# EAGLE design Board_v01 (EAGLE 8.1.0)
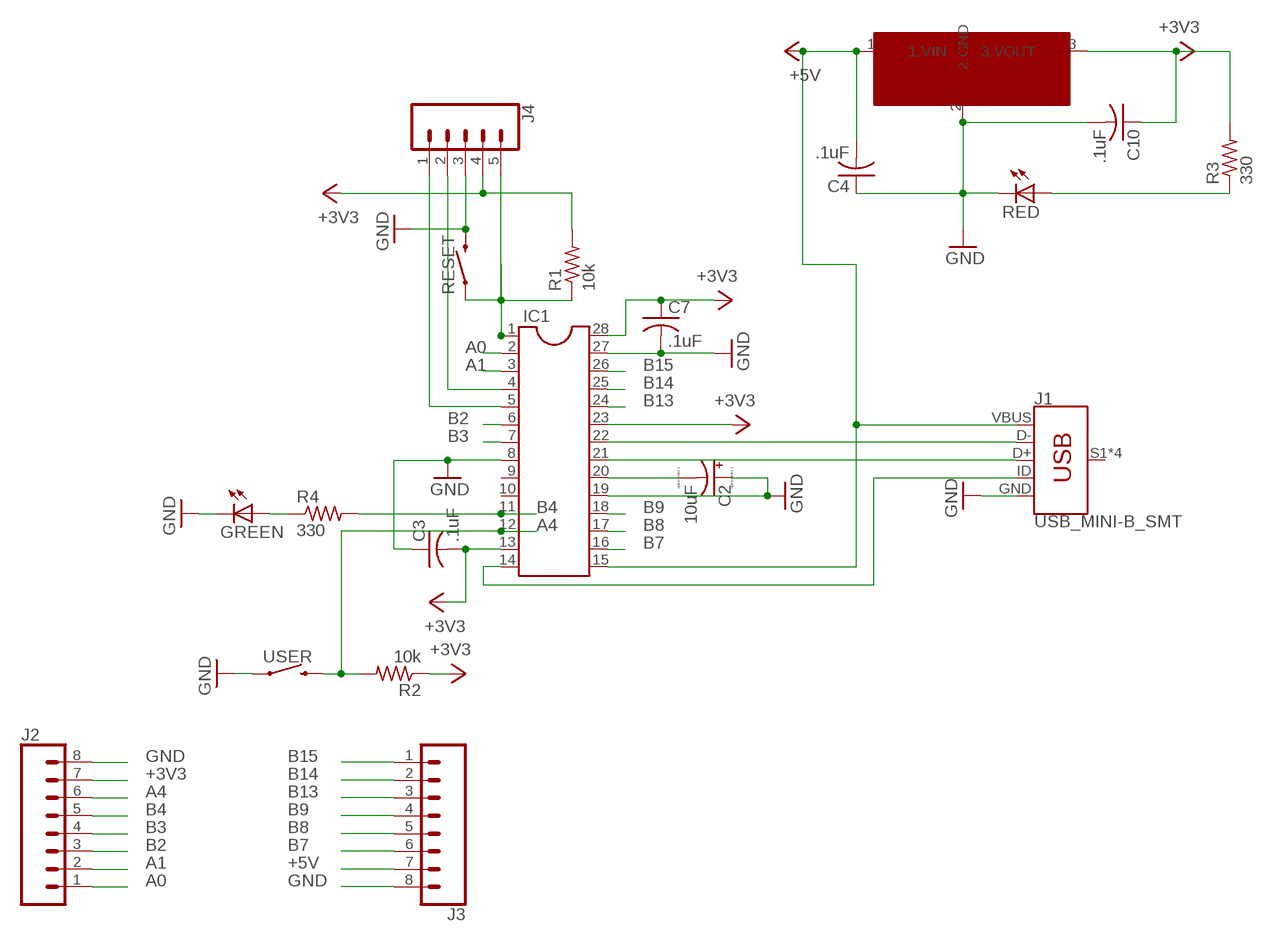
[diagram p0: schematic, sheet 1]

## Parts
C2  10uF  CPOL-USCT7343  [CT7343]
C3  .1uF  C-US025-025X050  [C025-025X050]
C4  .1uF  C-US025-025X050  [C025-025X050]
C7  .1uF  C-US025-025X050  [C025-025X050]
C10  .1uF  C-US025-025X050  [C025-025X050]
GREEN  LED3MM  [LED3MM]
IC1  DIL28-3  [DIL28-3]
J1  USB_MINI-B_SMT  [USB-MINIB]
J2  CONN_08"  [1X08]
J3  CONN_08"  [1X08]
J4  CONN_05  [1X05]
R1  10k  R-US_0204/5  [0204/5]
R2  10k  R-US_0204/5  [0204/5]
R3  330  R-US_0204/5  [0204/5]
R4  330  R-US_0204/5  [0204/5]
RED  LED3MM  [LED3MM]
RESET  MOMENTARY-SWITCH-SPST-PTH-6.0MM  [TACTILE_SWITCH_PTH_6.0MM]
U$1  MCP1702  [TO92]
USER  MOMENTARY-SWITCH-SPST-PTH-6.0MM  [TACTILE_SWITCH_PTH_6.0MM]

## Nets
+3V3: C3.2 C7.1 C10.1 IC1.13 IC1.23 IC1.28 J2.7 J4.4 R1.2 R2.1 R3.2 U$1.3(3.VOUT)
+5V: C4.2 IC1.15 J1.VBUS J3.7 U$1.1(1.VIN)
A0: IC1.2 J2.1
A1: IC1.3 J2.2
A4: IC1.12 J2.6 R2.2 USER.3
B2: IC1.6 J2.3
B3: IC1.7 J2.4
B4: IC1.11 J2.5 R4.2
B7: IC1.16 J3.6
B8: IC1.17 J3.5
B9: IC1.18 J3.4
B13: IC1.24 J3.3
B14: IC1.25 J3.2
B15: IC1.26 J3.1
GND: C2.+ C3.1 C4.1 C7.2 C10.2 GREEN.K(C) IC1.8 IC1.19 IC1.27 J1.GND J2.8 J3.8 J4.3 RED.K(C) RESET.3 U$1.2(2.GND) USER.1
N$1: IC1.1 J4.5 R1.1 RESET.1
N$2: IC1.4 J4.2
N$3: IC1.5 J4.1
N$4: IC1.22 J1.D-
N$5: IC1.21 J1.D+
N$7: IC1.14 J1.ID
N$8: C2.- IC1.20
N$9: GREEN.A R4.1
N$12: R3.1 RED.A
Unconnected: IC1.9 IC1.10 J1.S1(SHIELD) J1.S2(SHIELD) J1.S3(SHIELD) J1.S4(SHIELD)

## Library data of the parts
C2 = boardboardboard:CPOL-US: POLARIZED CAPACITOR, American symbol
C3 C4 C7 C10 = boardboardboard:C-US: CAPACITOR, American symbol
GREEN RED = boardboardboard:LED: LED OSRAM: - CHIPLED LG R971, LG N971, LY N971, LG Q971, LY Q971, LO R971, LY R971 LH N974, LH R974 LS Q976, LO Q976, LY Q976 LO Q996 - Hyper CHIPLED LW Q18S LB Q993, LB Q99A, LB R99A - SideLED LS A670, LO A670, LY A670, LG A670, LP A670 LB A673, LV A673, LT A673, LW A673 LH A674 LY A675 LS A676, LA A676, LO A676, LY A676, LW A676 LS A679, LY A679, LG A679 - Hyper Micro SIDELED® LS Y876, LA Y876, LO Y876, LY Y876 LT Y87S - SmartLED LW L88C, LW L88S LB L89C, LB L89S, LG L890 LS L89K, LO L89K, LY L89K LS L896, LA L896, LO L896, LY L896 - TOPLED LS T670, LO T670, LY T670, LG T670, LP T670 LSG T670, LSP T670, LSY T670, LOP T670, LYG T670 LG T671, LOG T671, LSG T671 LB T673, LV T673, LT T673, LW T673 LH T674 LS T676, LA T676, LO T676, LY T676, LB T676, LH T676, LSB T676, LW T676 LB T67C, LV T67C, LT T67C, LS T67K, LO T67K, LY T67K, LW E67C LS E67B, LA E67B, LO E67B, LY E67B, LB E67C, LV E67C, LT E67C LW T67C LS T679, LY T679, LG T679 LS T770, LO T770, LY T770, LG T770, LP T770 LB T773, LV T773, LT T773, LW T773 LH T774 LS E675, LA E675, LY E675, LS T675 LS T776, LA T776, LO T776, LY T776, LB T776 LHGB T686 LT T68C, LB T68C - Hyper Mini TOPLED® LB M676 - Mini TOPLED Santana® LG M470 LS M47K, LO M47K, LY M47K Source: http://www.osram.convergy.de LUXEON: - LUMILED® LXK2-PW12-R00, LXK2-PW12-S00, LXK2-PW14-U00, LXK2-PW14-V00 LXK2-PM12-R00, LXK2-PM12-S00, LXK2-PM14-U00 LXK2-PE12-Q00, LXK2-PE12-R00, LXK2-PE12-S00, LXK2-PE14-T00, LXK2-PE14-U00 LXK2-PB12-K00, LXK2-PB12-L00, LXK2-PB12-M00, LXK2-PB14-N00, LXK2-PB14-P00, LXK2-PB14-Q00 LXK2-PR12-L00, LXK2-PR12-M00, LXK2-PR14-Q00, LXK2-PR14-R00 LXK2-PD12-Q00, LXK2-PD12-R00, LXK2-PD12-S00 LXK2-PH12-R00, LXK2-PH12-S00 LXK2-PL12-P00, LXK2-PL12-Q00, LXK2-PL12-R00 Source: www.luxeon.com KINGBRIGHT: KA-3528ASYC Source: www.kingbright.com
IC1 = boardboardboard:DIL28: Dual In Line
J1 = boardboardboard:USB_MINI-B: USB type Mini-B Connector Breaks out 5th pin, and includes shield pins if needed. SparkFun Products: SparkFun FTDI Basic Breakout <https://www.sparkfun.com/products/9716> SparkFun XBee Explorer USB <https://www.sparkfun.com/products/11812> SparkFun Redboard <https://www.sparkfun.com/products/12757>; PROD_ID: CONN-08193; SF_ID: PRT-00587
J2 J3 = boardboardboard:CONN_08: Multi connection point. Often used as Generic Header-pin footprint for 0.1 inch spaced/style header connections On any of the 0.1 inch spaced packages, you can populate with these: Break Away Headers - Straight <https://www.sparkfun.com/products/116> (PRT-00116) Break Away Male Headers - Right Angle <https://www.sparkfun.com/products/553> (PRT-00553) Female Headers <https://www.sparkfun.com/products/115> (PRT-00115) Break Away Headers - Machine Pin <https://www.sparkfun.com/products/117> (PRT-00117) Break Away Female Headers - Swiss Machine Pin <https://www.sparkfun.com/products/743> (PRT-00743) Arduino Stackable Header - 8 Pin <https://www.sparkfun.com/products/9279> (PRT-09279) For SCREWTERMINALS and SPRING TERMINALS visit here: Screw Terimnals on SparkFun.com <https://www.sparkfun.com/search/results?term=Screw+Terminals> (5mm/3.5mm/2.54mm spacing) This device is also useful as a general connection point to wire up your design to another part of your project. Our various solder wires solder well into these plated through hole pads. Hook-Up Wire - Assortment (Stranded, 22 AWG) <https://www.sparkfun.com/products/11375> (PRT-11375) Hook-Up Wire - Assortment (Solid Core, 22 AWG) <https://www.sparkfun.com/products/11367> (PRT-11367) View the entire wire category on our website here <https://www.sparkfun.com/categories/141> Special notes: Molex polarized connector foot print use with SKU : PRT-08231 with associated crimp pins and housings. 1MM SMD Version SKU: PRT-10208 NOTES ON THE VARIANTS LOCK and LOCK_LONGPADS... This footprint was designed to help hold the alignment of a through-hole component (i.e. 6-pin header) while soldering it into place. You may notice that each hole has been shifted either up or down by 0.005 of an inch from it's more standard position (which is a perfectly straight line). This slight alteration caused the pins (the squares in the middle) to touch the edges of the holes. Because they are alternating, it causes a "brace" to hold the component in place. 0.005 has proven to be the perfect amount of "off-center" position when using our standard breakaway headers. Although looks a little odd when you look at the bare footprint, once you have a header in there, the alteration is very hard to notice. Also,if you push a header all the way into place, it is covered up entirely on the bottom side.; PROD_ID: CONN-08438
J4 = boardboardboard:CONN_05: Multi connection point. Often used as Generic Header-pin footprint for 0.1 inch spaced/style header connections On any of the 0.1 inch spaced packages, you can populate with these: Break Away Headers - Straight <https://www.sparkfun.com/products/116> (PRT-00116) Break Away Male Headers - Right Angle <https://www.sparkfun.com/products/553> (PRT-00553) Female Headers <https://www.sparkfun.com/products/115> (PRT-00115) Break Away Headers - Machine Pin <https://www.sparkfun.com/products/117> (PRT-00117) Break Away Female Headers - Swiss Machine Pin <https://www.sparkfun.com/products/743> (PRT-00743) For SCREWTERMINALS and SPRING TERMINALS visit here: Screw Terimnals on SparkFun.com <https://www.sparkfun.com/search/results?term=Screw+Terminals> (5mm/3.5mm/2.54mm spacing) This device is also useful as a general connection point to wire up your design to another part of your project. Our various solder wires solder well into these plated through hole pads. Hook-Up Wire - Assortment (Stranded, 22 AWG) <https://www.sparkfun.com/products/11375> (PRT-11375) Hook-Up Wire - Assortment (Solid Core, 22 AWG) <https://www.sparkfun.com/products/11367> (PRT-11367) View the entire wire category on our website here <https://www.sparkfun.com/categories/141> Special notes: Molex polarized connector foot print use with SKU : PRT-08231 with associated crimp pins and housings. 1MM SMD Version SKU: PRT-10208
R1-R4 = boardboardboard:R-US_: RESISTOR, American symbol
RESET USER = boardboardboard:MOMENTARY-SWITCH-SPST: Momentary Switch (Pushbutton) - SPST Normally-open (NO) SPST momentary switches (buttons, pushbuttons). Variants PTH-12MM - 12mm square, through-hole Momentary Pushbutton Switch - 12mm Square <https://www.sparkfun.com/products/9190> (COM-09190) PTH-6.0MM, PTH-6.0MM-KIT - 6.0mm square, through-hole Mini Pushbutton Switch <https://www.sparkfun.com/products/97> (COM-00097) KIT package intended for soldering kit's - only one side of pads' copper is exposed. PTH-RIGHT-ANGLE-KIT - Right-angle, through-hole Right Angle Tactile Button <https://www.sparkfun.com/products/10791> - Used on SparkFun BigTime Watch Kit <https://www.sparkfun.com/products/11734> SMD-12MM - 12mm square, surface-mount Tactile Button - SMD (12mm) <https://www.sparkfun.com/products/12993> (COM-12993) Used on SparkFun PicoBoard <https://www.sparkfun.com/products/11888> SMD-4.5MM - 4.5mm Square Trackball Switch Used on SparkFun Blackberry Trackballer Breakout <https://www.sparkfun.com/products/13169> SMD-4.6MMX2.8MM - 4.60mm x 2.80mm, surface mount Used on SparkFun SAMD21 Mini Breakout <https://www.sparkfun.com/products/13664> SMD-5.2MM, SMD-5.2-REDUNDANT - 5.2mm square, surface-mount Mini Pushbutton Switch - SMD <https://www.sparkfun.com/products/8720> (COM-08720) Used on Arduino Pro Mini <https://www.sparkfun.com/products/11114> REDUNDANT package connects both switch circuits together SMD-6.0X3.5MM - 6.0 x 3.5mm, surface mount Momentary Reset Switch SMD <https://www.sparkfun.com/products/8229> (COM-08229) SMD-6.2MM-TALL - 6.2mm square, surface mount Tactile Button - SMD (6mm) <https://www.sparkfun.com/products/12992> Used on SparkFun Digital Sandbox <https://www.sparkfun.com/products/12651> SMD-RIGHT-ANGLE - Right-angle, surface mount Used on SparkFun Block for Intel® Edison - Arduino <https://www.sparkfun.com/products/13036>; PROD_ID: SWCH-08441; SF_SKU: COM-00097
U$1 = boardboardboard:MCP1702

## Board
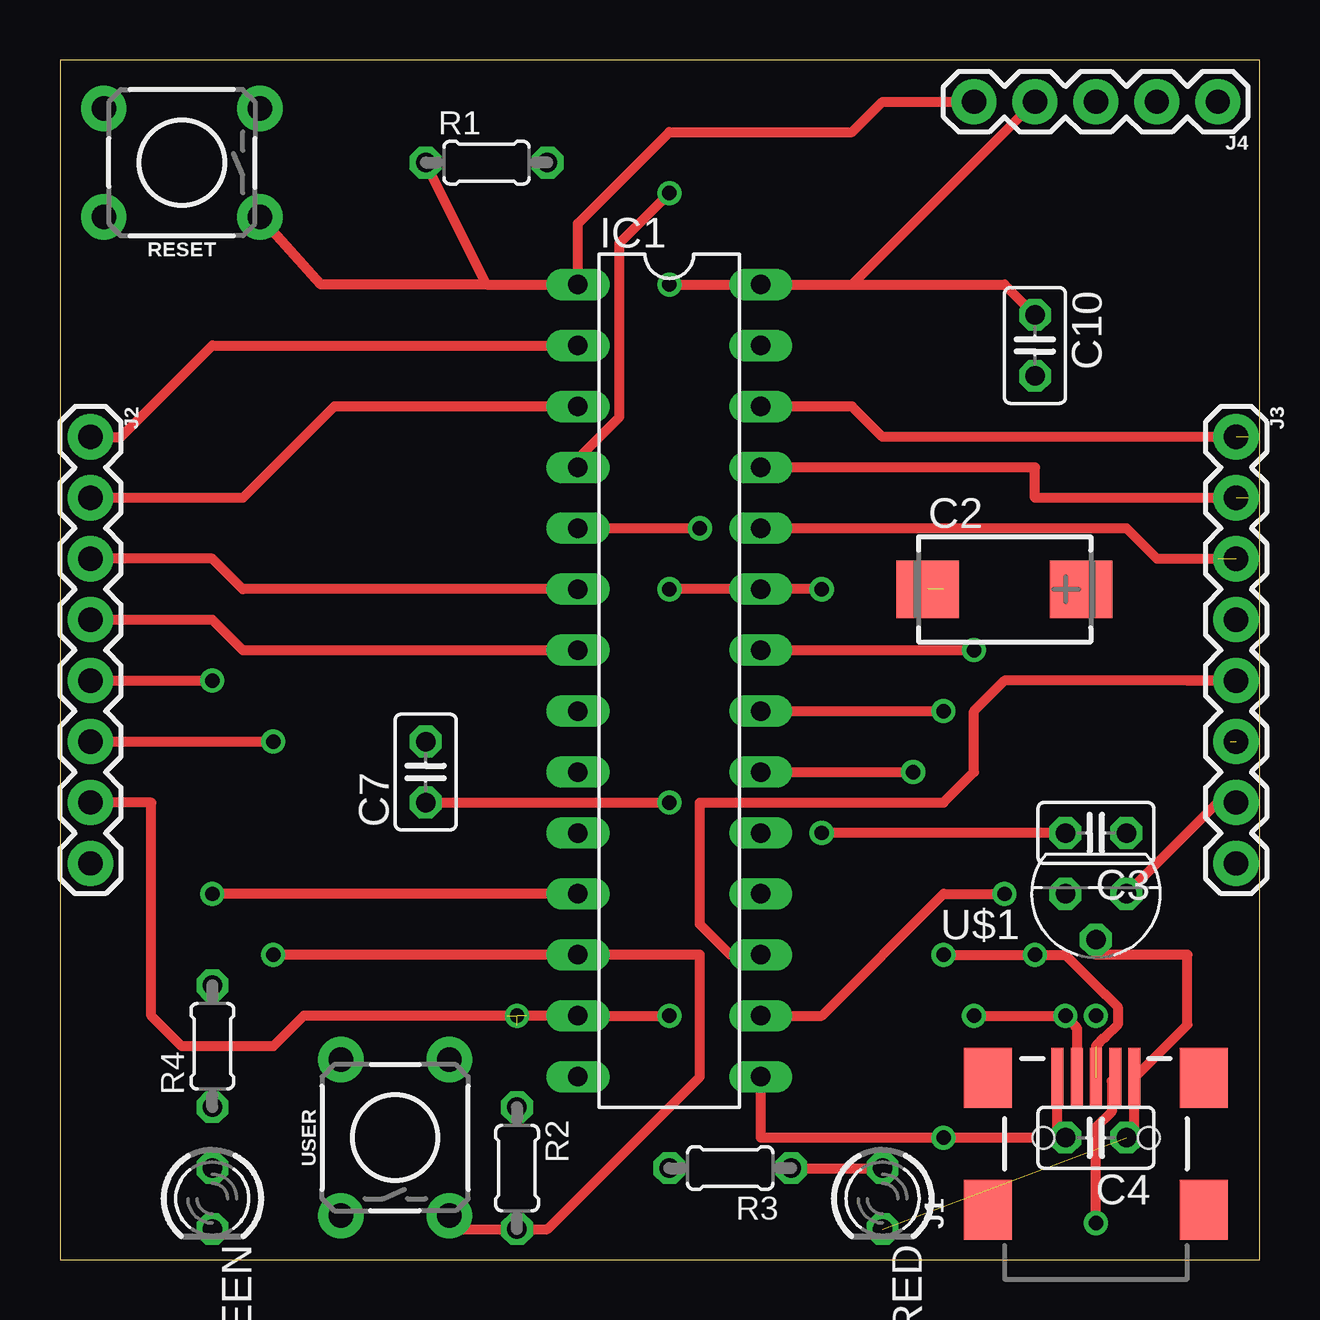
[diagram p1: board, top side]
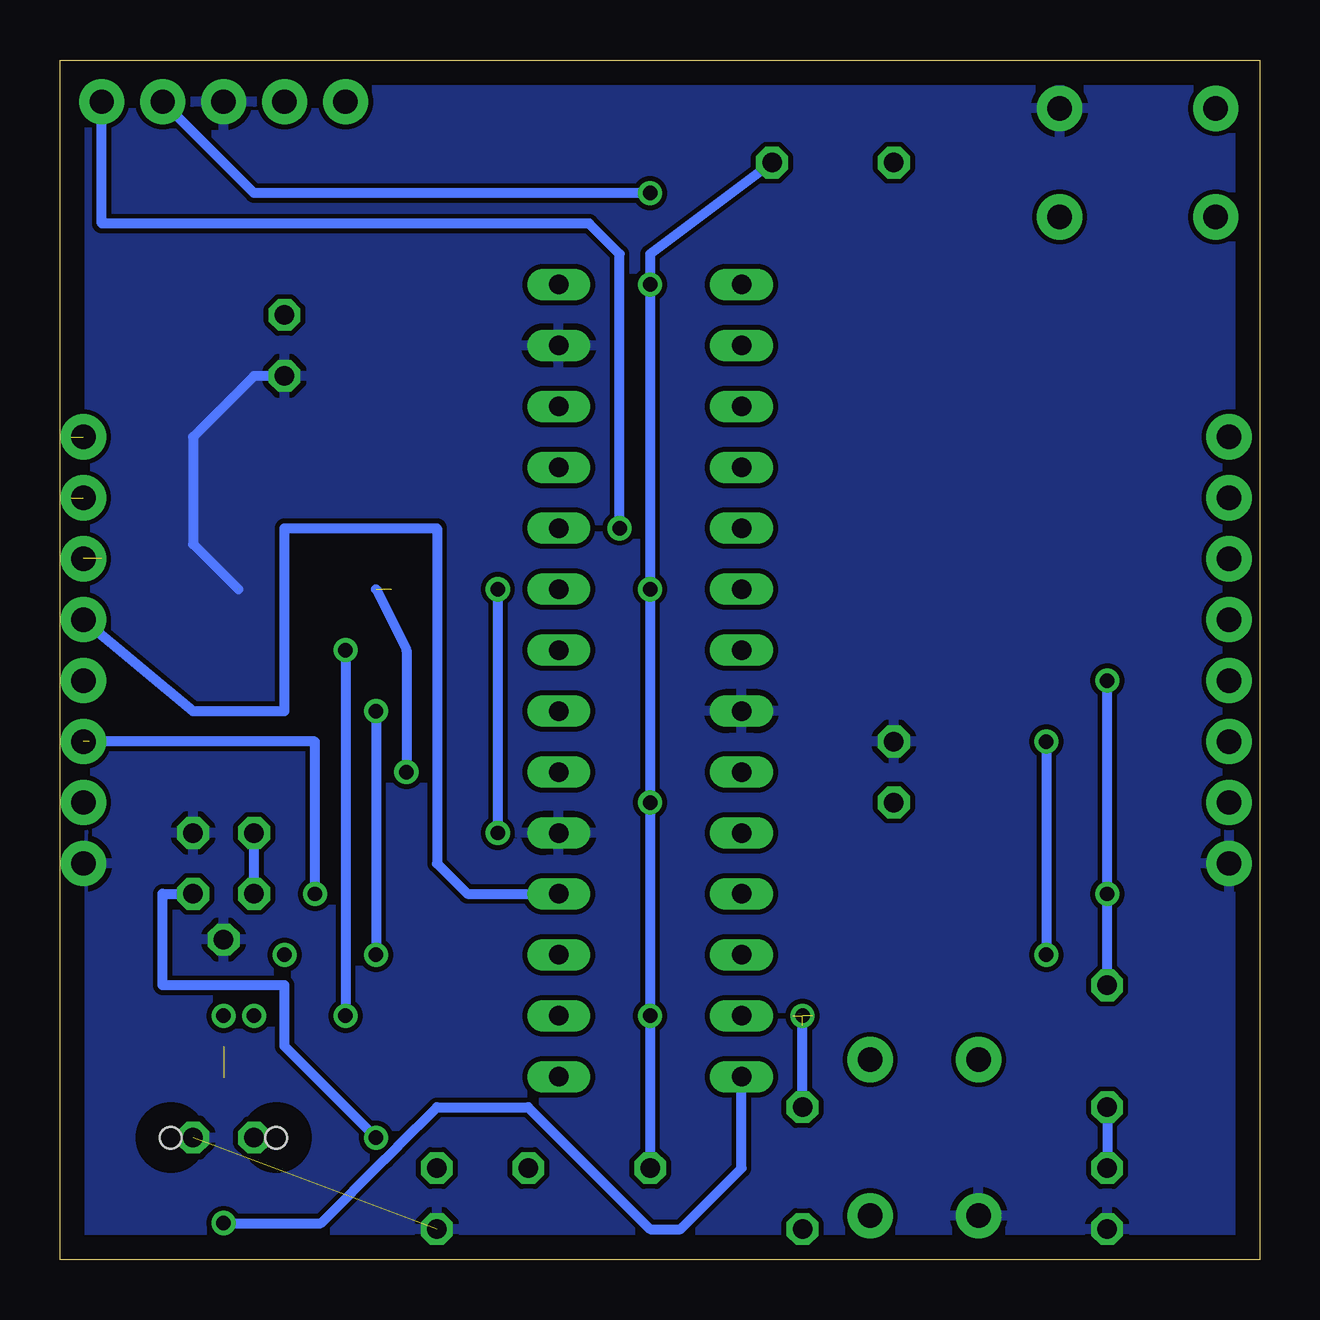
[diagram p2: board, bottom side, seen from below]

Size 50 x 50 mm. Coordinates in mm from the lower left corner, seen from the top.
Outline: 0,0 50,0 50,50 0,50 0,0
Copper layers (1*16): Top 0.035mm / dielectric 1.5mm / Bottom 0.035mm
Design rules "default": minimum track width 10mil, minimum drill 24mil, track to track 8mil, track to pad 8mil, pad to pad 8mil, via to via 8mil, smd to smd 8mil, copper to edge 40mil, drill to drill 8mil, minimum pad ring 10mil, minimum via ring 8mil, stop-mask expansion 4mil, vias tented up to drill 0mil, thermal gap 10mil

### Footprints (pad centres in the part's own frame; a part is rotated, then mirrored left to right if it is on the bottom)
CT7343 = smd 2.6 x 2.4: + 3.2,0; - -3.2,0
C025-025X050 = drill 0.813 octagon: 1 -1.27,0; 2 1.27,0
LED3MM = drill 0.813 octagon: A -1.27,0; K 1.27,0
DIL28-3 = drill 0.813 long: 1 -16.51,-3.81; 2 -13.97,-3.81; 3 -11.43,-3.81; 4 -8.89,-3.81; 5 -6.35,-3.81; 6 -3.81,-3.81; 7 -1.27,-3.81; 8 1.27,-3.81; 9 3.81,-3.81; 10 6.35,-3.81; 11 8.89,-3.81; 12 11.43,-3.81; 13 13.97,-3.81; 14 16.51,-3.81; 15 16.51,3.81; 16 13.97,3.81; 17 11.43,3.81; 18 8.89,3.81; 19 6.35,3.81; 20 3.81,3.81; 21 1.27,3.81; 22 -1.27,3.81; 23 -3.81,3.81; 24 -6.35,3.81; 25 -8.89,3.81; 26 -11.43,3.81; 27 -13.97,3.81; 28 -16.51,3.81
USB-MINIB = smd 2.5 x 0.5: D+ 2.5,0; D- 2.5,0.8; GND 2.5,-1.6; ID 2.5,-0.8; VBUS 2.5,1.6 | smd 2.5 x 2: S1 -3,4.5; S2 2.5,4.5; S3 -3,-4.5; S4 2.5,-4.5 | hole 0.9: 0,2.2; 0,-2.2
1X08 = drill 1.016 pad 1.88: 1 0,0; 2 2.54,0; 3 5.08,0; 4 7.62,0; 5 10.16,0; 6 12.7,0; 7 15.24,0; 8 17.78,0
1X05 = drill 1.016 pad 1.88: 1 0,0; 2 2.54,0; 3 5.08,0; 4 7.62,0; 5 10.16,0
0204/5 = drill 0.813 octagon: 1 -2.54,0; 2 2.54,0
TACTILE_SWITCH_PTH_6.0MM = drill 1.016 pad 1.88: 1 -3.251,2.261; 2 3.251,2.261; 3 -3.251,-2.261; 4 3.251,-2.261
TO92 = drill 0.813 octagon: 1 -1.27,0; 2 0,1.905; 3 1.27,0

### Placement (x,y rotation side)
C2  39.37,27.94 0 top
C3  43.18,17.78 180 top
C4  43.18,5.08 180 top
C7  15.24,20.32 90 top
C10  40.64,38.1 270 top
GREEN  6.35,2.54 270 top
IC1  25.4,24.13 270 top
J1  43.18,5.08 90 top
J2  1.27,34.29 270 top
J3  49.02,34.29 270 top
J4  48.26,48.26 180 top
R1  17.78,45.72 0 top
R2  19.05,3.81 270 top
R3  27.94,3.81 180 top
R4  6.35,8.89 90 top
RED  34.29,2.54 270 top
RESET  5.08,45.72 180 top
U$1  43.18,15.24 180 top
USER  13.97,5.08 90 top

### Tracks (layer width: path | path; a pad name or v marks a point on that pad's centre or on a via)
+3V3  (via drill 0.6)  (3 unrouted)
  Top 0.406: C3.2 v31.75,17.78 | v31.75,27.94 IC1.23 v25.4,27.94 | v25.4,10.16 IC1.13 19.46,10.16 | v25.4,40.64 IC1.28 | IC1.28 39.37,40.64 C10.1 | IC1.28 33.02,40.64 J4.4 | C7.1 v25.4,19.05 | J2.7 3.81,19.05 3.81,10.16 5.08,8.89 8.89,8.89 10.16,10.16 18.64,10.16
  Bottom 0.406: U$1.3 C3.2 | v31.75,17.78 v31.75,27.94 | R3.2 v25.4,10.16 v25.4,19.05 v25.4,27.94 v25.4,40.64 25.4,41.91 R1.2 | R2.1 19.05,9.75
  other vias: 19.05,10.16
+5V  (via drill 0.6)
  Top 0.406: J1.VBUS 41.58,5.08 C4.2 v36.83,5.08 29.21,5.08 IC1.15 | J3.7 48.26,19.05 U$1.1
  Bottom 0.406: v36.83,5.08 40.64,8.89 40.64,11.43 45.72,11.43 45.72,15.24 U$1.1
A0
  Top 0.406: J2.1 2.54,34.29 6.35,38.1 IC1.2
A1
  Top 0.406: IC1.3 11.43,35.56 7.62,31.75 J2.2
A4  (via drill 0.6)
  Top 0.406: USER.3 16.23,1.27 R2.2 20.32,1.27 26.67,7.62 26.67,12.7 IC1.12 v8.89,12.7 | J2.6 v8.89,21.59
  Bottom 0.406: v8.89,21.59 v8.89,12.7
B2
  Top 0.406: J2.3 6.35,29.21 7.62,27.94 IC1.6
B3
  Top 0.406: J2.4 6.35,26.67 7.62,25.4 IC1.7
B4  (via drill 0.6)
  Top 0.406: IC1.11 v6.35,15.24 | J2.5 v6.35,24.13
  Bottom 0.406: R4.2 v6.35,15.24 v6.35,24.13
B7  (via drill 0.6)  (1 unrouted)
  Top 0.406: IC1.16 31.75,10.16 36.83,15.24 v39.37,15.24
  Bottom 0.406: v39.37,15.24 39.37,21.59 48.78,21.59
B8
  Top 0.406: IC1.17 27.94,12.7 26.67,13.97 26.67,19.05 36.83,19.05 38.1,20.32 38.1,22.86 39.37,24.13 46.99,24.13 | 46.99,24.13 48.78,24.13 | J3.5 46.99,24.13
B9
  Bottom 0.406: J3.4 44.45,22.86 40.64,22.86 40.64,30.48 34.29,30.48 34.29,16.51 33.02,15.24 IC1.18
B13  (1 unrouted)
  Top 0.406: IC1.24 44.45,30.48 45.72,29.21 48.26,29.21
B14  (1 unrouted)
  Top 0.406: 49.53,31.75 40.64,31.75 40.64,33.02 IC1.25
B15  (1 unrouted)
  Top 0.406: 49.53,34.29 34.29,34.29 33.02,35.56 IC1.26
GND  (2 unrouted)
  Top 0.406: C4.1 44.78,5.08 J1.GND 46.99,9.79 46.99,12.7 43.18,12.7 U$1.2
  Bottom 0.406: C10.2 41.91,36.83 44.45,34.29 44.45,29.82 C2.+
  pour Bottom: 0,49.53 0,-1.27 49.53,-1.27 49.53,0 49.53,49.53
N$1
  Top 0.406: 17.78,40.64 10.87,40.64 RESET.1 | 17.78,40.64 IC1.1 21.59,43.18 25.4,46.99 33.02,46.99 34.29,48.26 J4.5 | 17.78,40.64 R1.1
N$2  (via drill 0.6)
  Top 0.406: IC1.4 21.59,33.39 23.32,35.12 23.32,42.37 v25.4,44.45
  Bottom 0.406: v25.4,44.45 41.91,44.45 J4.2
N$3  (via drill 0.6)
  Top 0.406: IC1.5 v26.67,30.48
  Bottom 0.406: v26.67,30.48 26.67,41.91 27.94,43.18 48.26,43.18 J4.1
N$4  (via drill 0.6)
  Top 0.406: IC1.22 v38.1,25.4 | v38.1,10.16 v41.91,10.16 42.27,9.8 42.27,9.78 42.38,9.67 J1.D-
  Bottom 0.406: v38.1,25.4 v38.1,10.16
N$5  (via drill 0.6)  (1 unrouted)
  Top 0.406: IC1.21 v36.83,22.86 | v36.83,12.7 v40.64,12.7 41.91,12.7 43.54,11.07 43.56,11.07 44.09,10.54 44.09,9.78 43.56,9.25 43.54,9.25 43.18,8.89
  Bottom 0.406: v36.83,22.86 v36.83,12.7
N$6  (via drill 0.6)
  other vias: 43.18,10.16
N$7  (via drill 0.6)
  Top 0.406: J1.ID 43.84,7.44 43.84,6.16 43.18,5.5 v43.18,1.52 43.18,1.27
  Bottom 0.406: v43.18,1.52 39.12,1.52 36.47,4.17 36.45,4.17 35.92,4.7 35.92,4.72 34.29,6.35 30.48,6.35 25.4,1.27 24.13,1.27 21.59,3.81 IC1.14
N$8  (via drill 0.6)  (1 unrouted)
  Top 0.406: IC1.20 v35.56,20.32
  Bottom 0.406: 36.83,27.94 35.56,25.4 v35.56,20.32
N$9
  Bottom 0.406: R4.1 GREEN.A
N$12
  Top 0.406: R3.1 RED.A